# Altium schematic sheet 电机驱动原理图.SchDoc
size A4
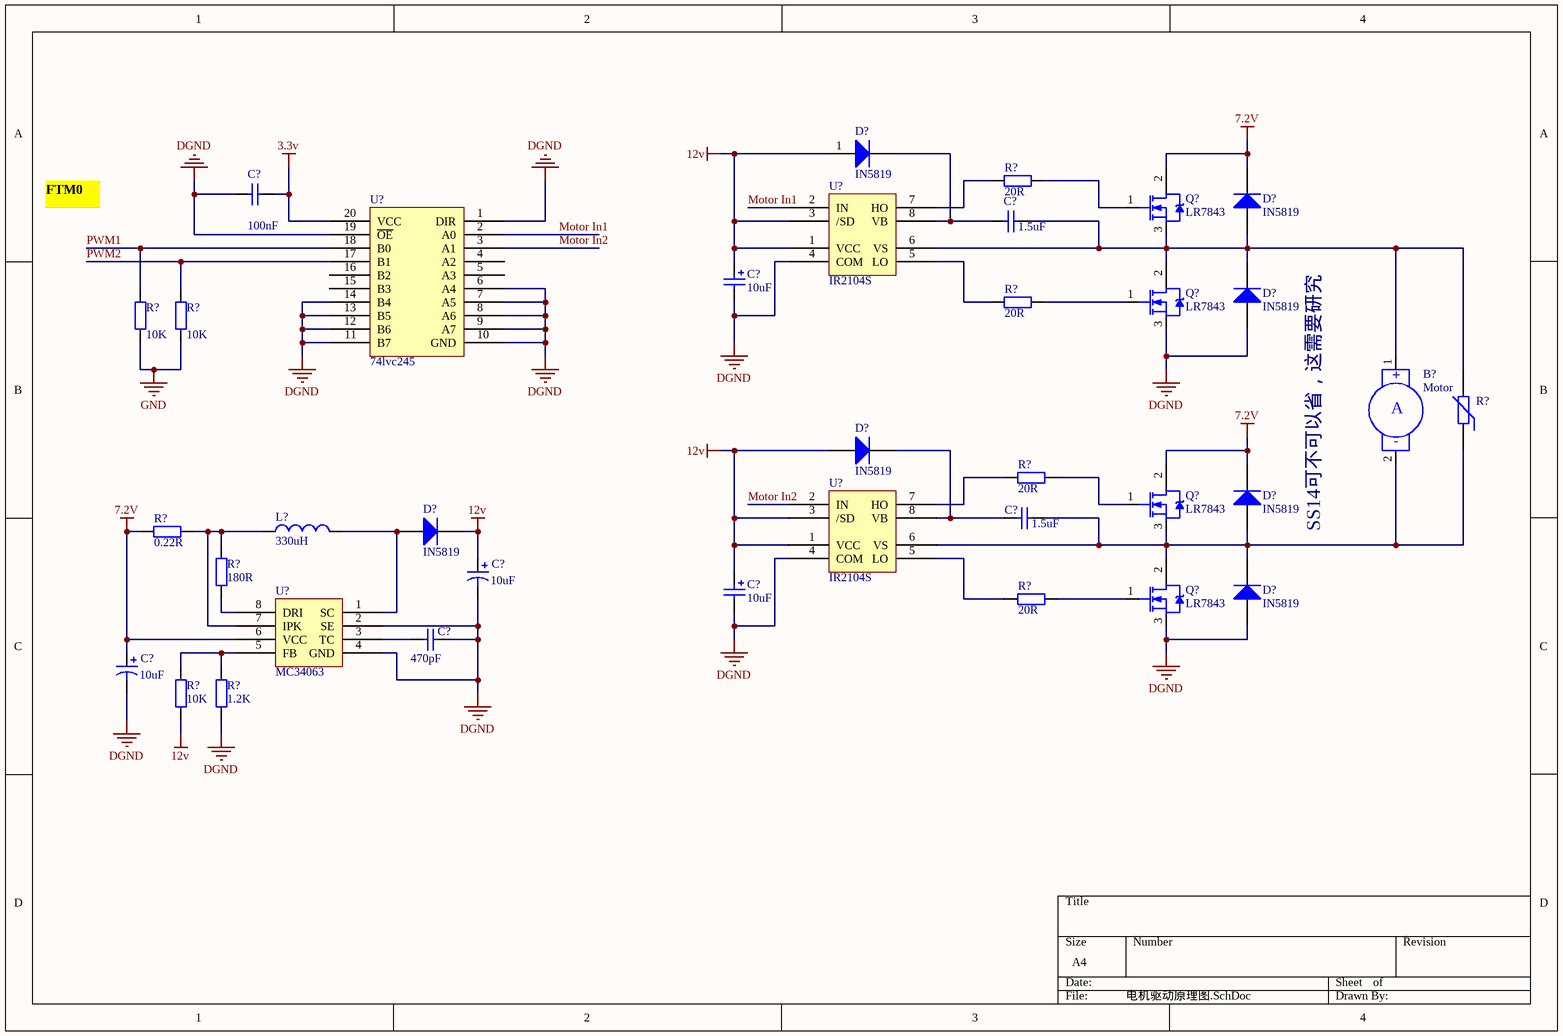
[diagram p0: 电机驱动原理图.SchDoc]

## Parts
(Parts that share a designator on the sheet are numbered #1, #2 ... from top to bottom, then left to right.)
B?  Motor  [7.2V]
C?#1  value 100nF  [C0603]  (hidden comment: Cap)
C?#2  value 1.5uF  [C0603]  (hidden comment: Cap Semi)
C?#3  value 10uF  [C0603]  (hidden comment: Cap Pol1)
C?#4  value 1.5uF  [C0603]  (hidden comment: Cap Semi)
C?#5  value 10uF  [钽电容]  (hidden comment: Cap Pol1)
C?#6  value 10uF  [C0603]  (hidden comment: Cap Pol1)
C?#7  value 470pF  [C0603]  (hidden comment: Cap Semi)
C?#8  value 10uF  [钽电容]  (hidden comment: Cap Pol1)
D?#1  IN5819  [二极管贴片]
D?#2  IN5819  [二极管贴片]
D?#3  IN5819  [二极管贴片]
D?#4  IN5819  [二极管贴片]
D?#5  IN5819  [二极管贴片]
D?#6  IN5819  [二极管贴片]
D?#7  IN5819  [二极管贴片]
L?  value 330uH  [221贴片电感]  (hidden comment: Inductor)
Q?#1  LR7843  [LR7843]
Q?#2  LR7843  [LR7843]
Q?#3  LR7843  [LR7843]
Q?#4  LR7843  [LR7843]
R?#1  value 20R  [R0603]  (hidden comment: Res2)
R?#2  value 20R  [R0603]  (hidden comment: Res2)
R?#3  value 10K  [R0603]  (hidden comment: Res2)
R?#4  value 10K  [C0603]  (hidden comment: Res2)
R?#5  Res Varistor  [R0603]  (value not drawn)
R?#6  value 20R  [R0603]  (hidden comment: Res2)
R?#7  value 0.22R  [R0603]  (hidden comment: Res2)
R?#8  value 180R  [R0603]  (hidden comment: Res2)
R?#9  value 20R  [R0603]  (hidden comment: Res2)
R?#10  value 10K  [R0603]  (hidden comment: Res2)
R?#11  value 1.2K  [R0603]  (hidden comment: Res2)
U?#1  74lvc245  [74LVC245 TSSOP]
U?#2  IR2104S  [IR2104]
U?#3  IR2104S  [IR2104]
U?#4  MC34063  [MC34063]

## Nets
3.3v: C?#1.2 U?#1.20(VCC)
7.2V: C?#8.1 D?#2.2(K) D?#5.2(K) Q?#1.2(D) Q?#3.2(D) R?#7.1 U?#4.6(VCC)
12v: C?#3.1 C?#5.1 C?#6.1 D?#1.1(A) D?#4.1(A) D?#6.2(K) R?#10.2 U?#2.1(VCC) U?#2.3(/SD) U?#3.1(VCC) U?#3.3(/SD)
DGND: C?#1.1 C?#3.2 C?#5.2 C?#6.2 C?#7.2 C?#8.2 D?#3.1(A) D?#7.1(A) Q?#2.3(S) Q?#4.3(S) R?#11.1 U?#1.1(DIR) U?#1.6(A4) U?#1.7(A5) U?#1.8(A6) U?#1.9(A7) U?#1.10(GND) U?#1.11(B7) U?#1.12(B6) U?#1.13(B5) U?#1.14(B4) U?#1.19(~{OE}) U?#2.4(COM) U?#3.4(COM) U?#4.2(SE) U?#4.4(GND)
GND: R?#3.1 R?#4.1
Motor In1: U?#1.2(A0) U?#2.2(IN)
Motor In2: U?#1.3(A1) U?#3.2(IN)
PWM1: R?#3.2 U?#1.18(B0)
PWM2: R?#4.2 U?#1.17(B1)
NetB?_1: B?.1(+) C?#2.2 D?#2.1(A) D?#3.2(K) Q?#1.3(S) Q?#2.2(D) R?#5.2 U?#2.6(VS)
NetB?_2: B?.2(-) C?#4.2 D?#5.1(A) D?#7.2(K) Q?#3.3(S) Q?#4.2(D) R?#5.1 U?#3.6(VS)
NetC?#2_1: C?#2.1 D?#1.2(K) U?#2.8(VB)
NetC?#4_1: C?#4.1 D?#4.2(K) U?#3.8(VB)
NetC?#7_1: C?#7.1 U?#4.3(TC)
NetD?#6_1: D?#6.1(A) L?.2 U?#4.1(SC)
NetL?_1: L?.1 R?#7.2 R?#8.2 U?#4.7(IPK)
NetQ?#1_1: Q?#1.1(G) R?#1.2
NetQ?#2_1: Q?#2.1(G) R?#2.2
NetQ?#3_1: Q?#3.1(G) R?#6.2
NetQ?#4_1: Q?#4.1(G) R?#9.2
NetR?#1_1: R?#1.1 U?#2.7(HO)
NetR?#2_1: R?#2.1 U?#2.5(LO)
NetR?#6_1: R?#6.1 U?#3.7(HO)
NetR?#8_1: R?#8.1 U?#4.8(DRI)
NetR?#9_1: R?#9.1 U?#3.5(LO)
NetR?#10_1: R?#10.1 R?#11.2 U?#4.5(FB)

Not connected (* = marked no-connect by the designer): U?#1 4(A2) 5(A3) 15(B3) 16(B2)

## Notes on the sheet
- FTM0
- SS14可不可以省，这需要研究
- (in symbol Motor Servo) A

## Library data of the parts
B? = Motor Servo: Servo Motor
C?#1 = Cap: Capacitor; Published: 8-Jun-2000; LatestRevisionDate: 17-Jul-2002; LatestRevisionNote: Re-released for DXP Platform.; PackageReference: RAD-0.3; Publisher: Altium Limited; PackageDescription: Radial Cap, Thru-Hole; 2 Leads; 0.3 in Pin Spacing
C?#2 C?#4 C?#7 = Cap Semi: Capacitor (Semiconductor SIM Model); Published: 8-Jun-2000; LatestRevisionDate: 29-May-2009; LatestRevisionNote: IPC-7351 Footprint Added.; PackageReference: C1206; Publisher: Altium Limited; PackageDescription: Chip Capacitor
C?#3 C?#5 C?#6 C?#8 = Cap Pol1: Polarized Capacitor (Radial); Published: 8-Jun-2000; LatestRevisionDate: 17-Jul-2002; LatestRevisionNote: Re-released for DXP Platform.; PackageReference: RB7.6-15; Publisher: Altium Limited
  C?#3 C?#6: PackageDescription: Polarized Capacitor (Radial); 2 Leads
D?#1-D?#7 = Diode: Default Diode; PackageVersion: Sep-1996; PackageDescription: DO-214-AB/SMC; 2 C-Bend Leads; Body 7.9 x 5.9 mm, inc. leads (LxW); Code_JEDEC: DO-214-AB
L? = Inductor: Code_IEC: 1005; Published: 8-Jun-2000; LatestRevisionDate: 29-May-2009; LatestRevisionNote: IPC-7351 Footprint Added.; PackageReference: 0402-A; Publisher: Altium Limited; PackageDescription: Chip Inductor; Code_JEITA: 0402
Q?#1-Q?#4 = NMOS-2: N-Channel Power MOSFET; Note: Pin 2 is electrically connected to pin 4.; Published: 8-Jun-2000; LatestRevisionDate: 17-Jul-2002; LatestRevisionNote: Re-released for DXP Platform.; DatasheetVersion: PD-9.814; PackageVersion: Feb-1997; PackageReference: TO-220AB; Publisher: Altium Limited; PackageDescription: TO, Thru-Hole, Vertical, Heatsink Mounted; 3 In-Line Leads; Pitch 2.54 mm; ComponentLink1Description: Manufacturer Link; ComponentLink1URL: http://www.irf.com/
R?#1-R?#4 R?#6-R?#11 = Res2: Resistor; Published: 8-Jun-2000; LatestRevisionDate: 17-Jul-2002; LatestRevisionNote: Re-released for DXP Platform.; PackageReference: AXIAL-0.4; Publisher: Altium Limited; PackageDescription: Axial Device, Thru-Hole; 2 Leads; 0.4 in Pin Spacing
R?#5 = Res Varistor: Varistor (Voltage-Sensitive Resistor); Published: 24-Mar-1999; LatestRevisionDate: 04-Mar-2005; LatestRevisionNote: PCB Footprint replaced.; PackageReference: 6-0805; Publisher: Altium Limited
U?#1 = 74lvc245: 8位5伏转3.3伏电平转换芯片
U?#2 U?#3 = Component_1_1
U?#4 = MC34063: Header, 2-Pin